# Altium schematic sheet Power.SchDoc
size A4; SheetNumber: 2; SheetTotal: 3
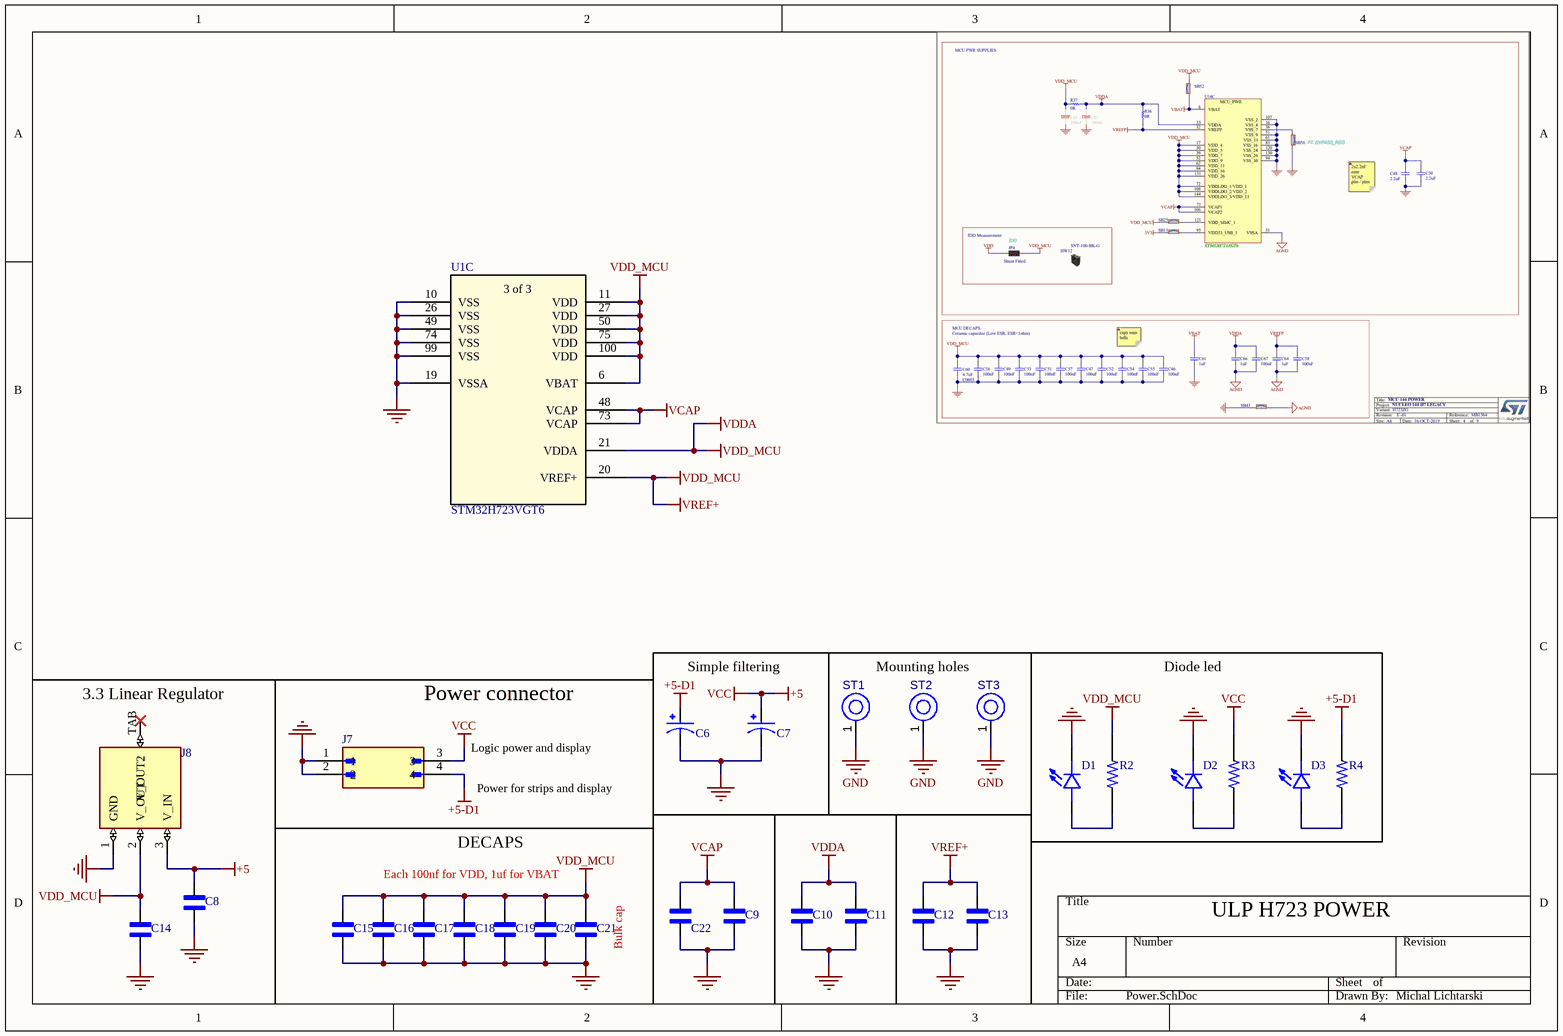
[diagram p0: Power.SchDoc]

## Parts
C6  EEEFT1E101AP  [CAP_EEEFT1E101AP]  (value not drawn)
C7  EEEFT1E101AP  [CAP_EEEFT1E101AP]  (value not drawn)
C8  CL10A105KA8NNNC  [CAPC1608X90N]  (value not drawn)
C9  CL10A225KO8NNNC  [CAPC1608X90N]  (value not drawn)
C10  CL10A105KA8NNNC  [CAPC1608X90N]  (value not drawn)
C11  06035C104KAT2A  [CAPC1608X90N]  (value not drawn)
C12  CL10A105KA8NNNC  [CAPC1608X90N]  (value not drawn)
C13  06035C104KAT2A  [CAPC1608X90N]  (value not drawn)
C14  CL10A105KA8NNNC  [CAPC1608X90N]  (value not drawn)
C15  CL10A105KA8NNNC  [CAPC1608X90N]  (value not drawn)
C16  06035C104KAT2A  [CAPC1608X90N]  (value not drawn)
C17  06035C104KAT2A  [CAPC1608X90N]  (value not drawn)
C18  06035C104KAT2A  [CAPC1608X90N]  (value not drawn)
C19  06035C104KAT2A  [CAPC1608X90N]  (value not drawn)
C20  06035C104KAT2A  [CAPC1608X90N]  (value not drawn)
C21  CL10A475MA8NQNC  [CAPC1608X90N]  (value not drawn)
C22  CL10A225KO8NNNC  [CAPC1608X90N]  (value not drawn)
D1  LTST-C190KGKT  [LEDC1608X35N]  (value not drawn)
D2  LTST-C191TBKT  [LEDC1608X35N]  (value not drawn)
D3  LTST-C191TBKT  [LEDC1608X35N]  (value not drawn)
J7  353180420  [MOLEX_353180420]  (value not drawn)
J8  LD1117AS33TR  [SOT223]  (value not drawn)
R2  RP73PF1J10KBTDF  [RESC1608X50N]  (value not drawn)
R3  RP73PF1J10KBTDF  [RESC1608X50N]  (value not drawn)
R4  RP73PF1J10KBTDF  [RESC1608X50N]  (value not drawn)
ST1  PTH-M2D5X5  [PTH-M2D5X5]  (value not drawn)
ST2  PTH-M2D5X5  [PTH-M2D5X5]  (value not drawn)
ST3  PTH-M2D5X5  [PTH-M2D5X5]  (value not drawn)
U1  STM32H723VGT6  [LQFP100_STM]  (part C of 3)

## Nets
+5: C7.1 C8.1 J7.3 J8.3(V_IN) R3.2  [also labelled VCC]
+5-D1: C6.1 J7.4 R4.2
GND: C6.2 C7.2 C8.2 C9.1 C10.2 C11.1 C12.2 C13.1 C14.2 C15.2 C16.1 C17.1 C18.1 C19.1 C20.1 C21.1 C22.2 D1.C D2.C D3.C J7.1 J7.2 J8.1(GND) ST1.1(H1) ST2.1(H1) ST3.1(H1) U1.10(VSS) U1.19(VSSA) U1.26(VSS) U1.49(VSS) U1.74(VSS) U1.99(VSS)
VCAP: C9.2 C22.1 U1.48(VCAP) U1.73(VCAP)
VDD_MCU: C10.1 C11.2 C12.1 C13.2 C14.1 C15.1 C16.2 C17.2 C18.2 C19.2 C20.2 C21.2 J8.2(V_OUT) R2.2 U1.6(VBAT) U1.11(VDD) U1.20(VREF+) U1.21(VDDA) U1.27(VDD) U1.50(VDD) U1.75(VDD) U1.100(VDD)  [also labelled VDDA, VREF+]
NetD1_A: D1.A R2.1
NetD2_A: D2.A R3.1
NetD3_A: D3.A R4.1

Not connected (* = marked no-connect by the designer): J8 TAB(V_OUT2)*

## Notes on the sheet
- (near J8) 3.3 Linear Regulator
- Power connector
- Simple filtering
- Mounting holes
- Diode led
- (near J7) Logic power and display
- (near J7) Power for strips and display
- DECAPS
- Each 100nf for VDD, 1uf for VBAT
- ULP H723 POWER
- (near C21) Bulk cap
- Michal Lichtarski
- (in symbol STM32H723VGT6, part C) 3 of 3

## Library data of the parts
C6 C7 = EEEFT1E101AP: 10uF 25V; MF: {'manufacturer': u'Panasonic Electronic'}; Package: None; Price: None; Value: *; MP: EEEFT1E101AP; Availability: Unavailable
C8 C14 = CL10A105KA8NNNC: 10uf 0603; MF: {'manufacturer': u'Samsung Electro-Mechanics'}; Package: None; Price: None; Value: *; MP: CL10A105KA8NNNC; Availability: Unavailable
C9 C22 = 06035C104KAT2A: 2,2uf 0603; MF: {'manufacturer': u'AVX'}; Package: None; Price: None; Value: *; MP: 06035C104KAT2A; Availability: Unavailable
C10 C12 C15 = CL10A105KA8NNNC: 1uf 0603; MF: {'manufacturer': u'Samsung Electro-Mechanics'}; Package: None; Price: None; Value: *; MP: CL10A105KA8NNNC; Availability: Unavailable
C11 C13 C16-C20 = 06035C104KAT2A: 100nf 0603; MF: {'manufacturer': u'AVX'}; Package: None; Price: None; Value: *; MP: 06035C104KAT2A; Availability: Unavailable
C21 = 06035C104KAT2A: 4,7uf 0603; MF: {'manufacturer': u'AVX'}; Package: None; Price: None; Value: *; MP: 06035C104KAT2A; Availability: Unavailable
D1 = LTST-C190KGKT: LED; SMD; 0603; Green; 18-180mcd; 1.6x0.8x0.8mm; 130Â°; 1.6Ă·2.4V; 20mA <a href="https://pricing.snapeda.com/parts/LTST-C190KGKT/Lite-On%20Inc./view-part?ref=eda">Check availability</a>; MF: {'manufacturer': u'Lite-On Electronics'}; Package: None; Price: None; Value: *; MP: LTST-C190KGKT; Availability: Unavailable
D2 D3 = LTST-C190KGKT: 0603 blue; MF: {'manufacturer': u'Lite-On Electronics'}; Package: None; Price: None; Value: *; MP: LTST-C190KGKT; Availability: Unavailable
J7 = 353180420: Connector Header Through Hole, Right Angle 4 position 0.165in (4.20mm); MF: {'manufacturer': u'Molex'}; Package: None; Price: None; Value: *; MP: 353180420; Availability: Unavailable
J8 = LD1117AS33: Linear Voltage Regulator 3.3V, 1.15V drop; MF: STMicroelectronics; Check_prices: https://www.snapeda.com/parts/LD1117AS33/STMicroelectronics/view-part/?ref=eda; Value: *; Availability: In Stock; MP: LD1117AS33; Price: None; Package: SOT-223 STMicroelectronics; SnapEDA_Link: https://www.snapeda.com/parts/LD1117AS33/STMicroelectronics/view-part/?ref=snap; Purchase-URL: https://pricing.snapeda.com/search/part/LD1117AS33/?ref=eda
R2 = RP73PF1J10KBTDF: 80Ohm 0603; MF: {'manufacturer': u'TE Connectivity'}; Package: None; Price: None; Value: *; MP: RP73PF1J10KBTDF; Availability: Unavailable
R3 R4 = RP73PF1J10KBTDF: 20Ohm 0603; MF: {'manufacturer': u'TE Connectivity'}; Package: None; Price: None; Value: *; MP: RP73PF1J10KBTDF; Availability: Unavailable
ST1-ST3 = CMP-00028-00004-2: M2 PTH (2.5mm), 5mm pad; Pins: 1
U1 = STM32H723VGT6: No Description Available; Mfr_Name: STMicroelectronics; Copyright: Copyright (C) 2023 Ultra Librarian. All rights reserved.; Manufacturer_Part_Number: STM32H723VGT6; RefDes: RefDes; Type: DEV